# Altium schematic sheet MCU.SchDoc
size 431 x 279 mm; DocumentNumber: 3; SheetNumber: 3; SheetTotal: 7
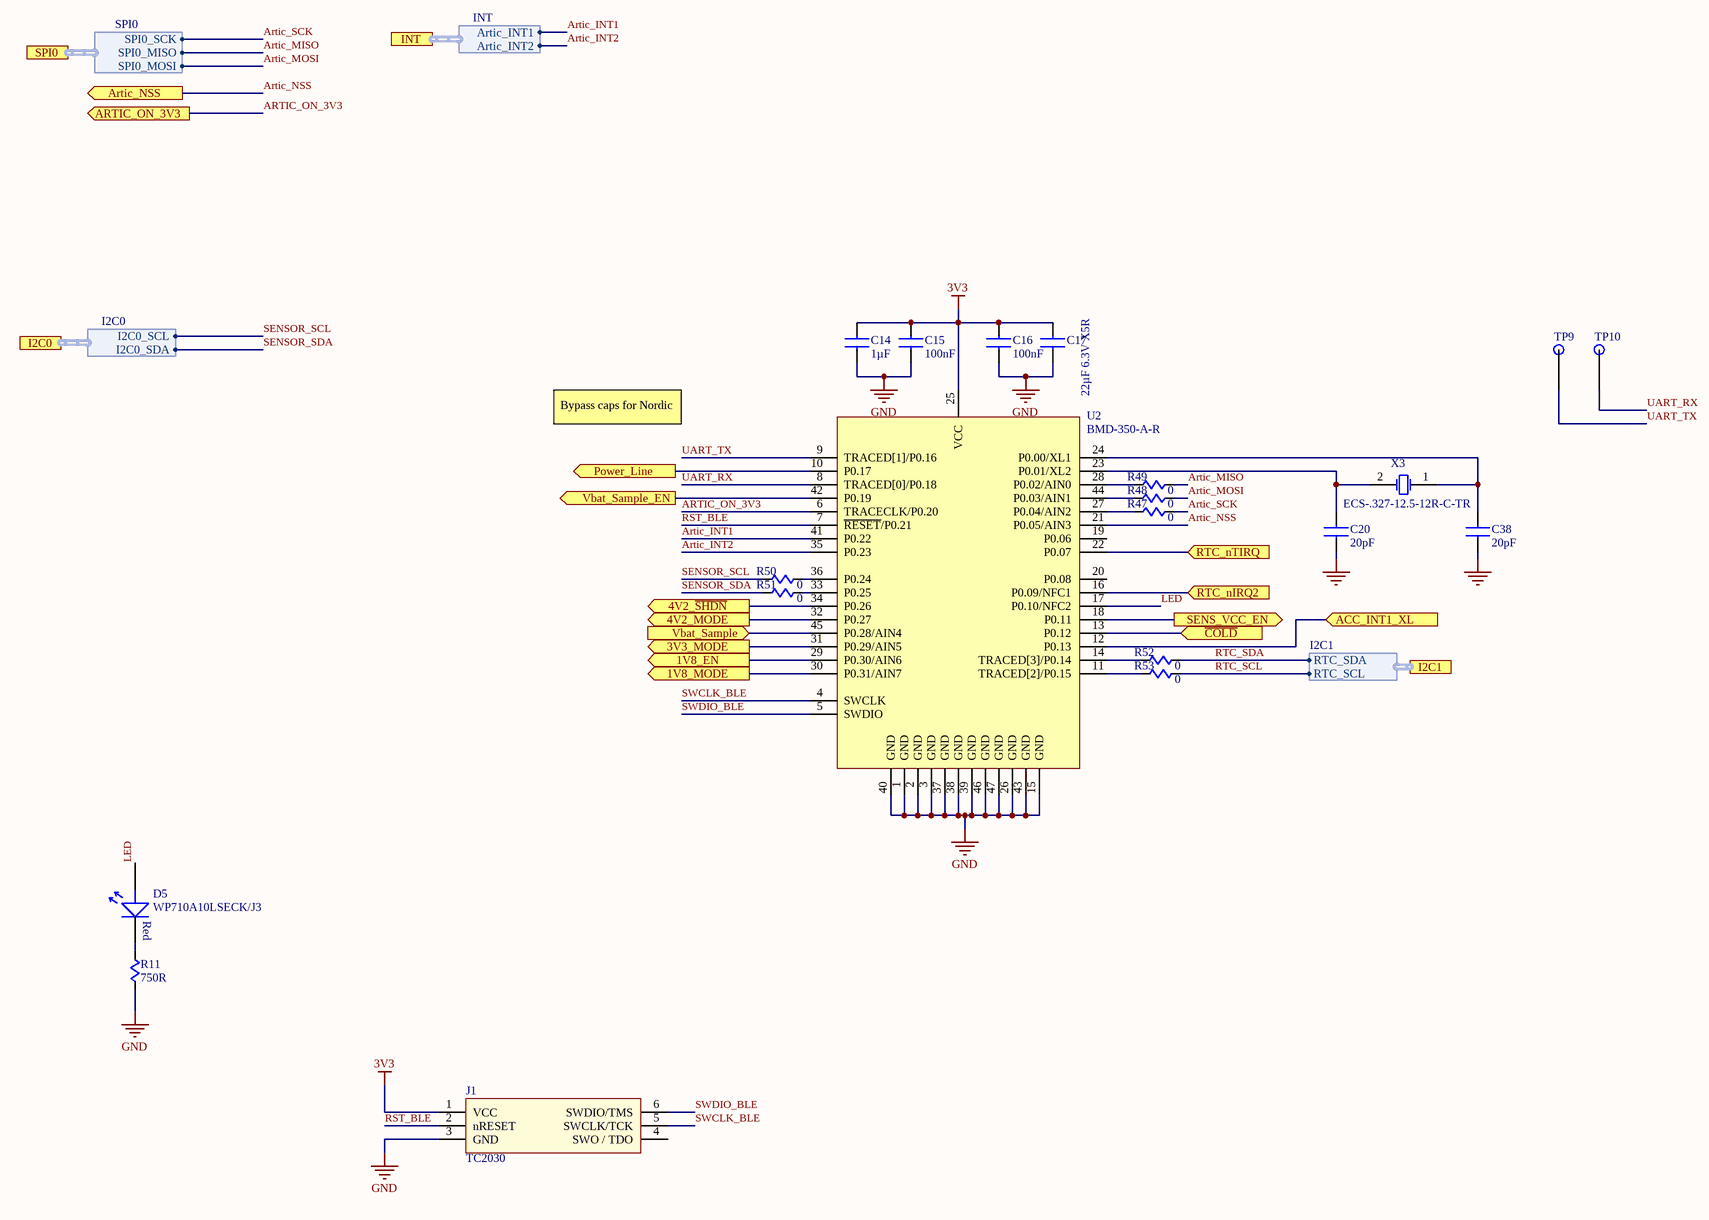
[diagram p0: MCU.SchDoc]

## Parts
C14  1µF  [CAPC1005N-0402]
C15  100nF  [CAPC1005N-0402]
C16  100nF  [CAPC1005N-0402]
C17  22µF 6.3V X5R  [CAPC1608N-0603]
C20  20pF  [CAPC1005N-0402]
C38  20pF  [CAPC1005N-0402]
D5  WP710A10LSECK/J3  [T-1 (3mm)]
J1  TC2030  [TC2030 - No Clips]  (no BOM)
R11  750R  [Chip Res 1608_0603 MMC]
R47  0  [RESC0402(1005)_N]
R48  0  [RESC0402(1005)_N]
R49  0  [RESC0402(1005)_N]
R50  0  [RESC0402(1005)_N]
R51  0  [RESC0402(1005)_N]
R52  0  [RESC0402(1005)_N]
R53  0  [RESC0402(1005)_N]
TP9  (no value)  [TestPoint_1mm]  (no BOM)
TP10  (no value)  [TestPoint_1mm]  (no BOM)
U2  BMD-350-A-R  [BMD-350]
X3  ECS-.327-12.5-12R-C-TR  [ECS-.327-12.5-12R-C-TR]

## Ports
1V8_EN (out), 1V8_MODE (out), 3V3_MODE (out), 4V2_MODE (out), 4V2_~{SHDN} (out), ACC_INT1_XL (in), Artic_NSS (out), ARTIC_ON_3V3 (out), I2C0 (harness I2C0), I2C1 (harness I2C1), INT (harness INT), Power_Line (out), RTC_nIRQ2 (in), RTC_nTIRQ (in), SENS_VCC_EN (out), SPI0 (harness SPI0), Vbat_Sample (in), Vbat_Sample_EN (out), ~{COLD} (in)

## Harnesses
I2C1: RTC_SDA, RTC_SCL
SPI0: SPI0_SCK, SPI0_MISO, SPI0_MOSI
I2C0: I2C0_SCL, I2C0_SDA
INT: Artic_INT1, Artic_INT2

## Nets
3V3: C14.1 C15.1 C16.1 C17.1 J1.1(VCC) U2.25(VCC)
GND: C14.2 C15.2 C16.2 C17.2 C20.2 C38.2 J1.3(GND) R11.1 U2.1(GND) U2.2(GND) U2.3(GND) U2.15(GND) U2.26(GND) U2.37(GND) U2.38(GND) U2.39(GND) U2.40(GND) U2.43(GND) U2.46(GND) U2.47(GND)
1V8_EN: U2.29(P0.30/AIN6) ; port 1V8_EN
1V8_MODE: U2.30(P0.31/AIN7) ; port 1V8_MODE
3V3_MODE: U2.31(P0.29/AIN5) ; port 3V3_MODE
4V2_MODE: U2.32(P0.27) ; port 4V2_MODE
4V2_~{SHDN}: U2.34(P0.26) ; port 4V2_~{SHDN}
~{COLD}: U2.13(P0.12) ; port ~{COLD}
ACC_INT1_XL: U2.12(P0.13) ; port ACC_INT1_XL
Artic_INT1: U2.41(P0.22) ; port INT.Artic_INT1
Artic_INT2: U2.35(P0.23) ; port INT.Artic_INT2
Artic_MISO: R49.2 ; port SPI0.SPI0_MISO
Artic_MOSI: R48.2 ; port SPI0.SPI0_MOSI
Artic_NSS: U2.21(P0.05/AIN3) ; port Artic_NSS
ARTIC_ON_3V3: U2.6(TRACECLK/P0.20) ; port ARTIC_ON_3V3
Artic_SCK: R47.2 ; port SPI0.SPI0_SCK
LED: D5.1(Anode) U2.17(P0.10/NFC2)
Power_Line: U2.10(P0.17) ; port Power_Line
RST_BLE: J1.2(nRESET) U2.7(~{RESET}/P0.21)
RTC_nIRQ2: U2.16(P0.09/NFC1) ; port RTC_nIRQ2
RTC_nTIRQ: U2.22(P0.07) ; port RTC_nTIRQ
RTC_SCL: R53.2 ; port I2C1.RTC_SCL
RTC_SDA: R52.2 ; port I2C1.RTC_SDA
SENS_VCC_EN: U2.18(P0.11) ; port SENS_VCC_EN
SENSOR_SCL: R50.1 ; port I2C0.I2C0_SCL
SENSOR_SDA: R51.1 ; port I2C0.I2C0_SDA
SWCLK_BLE: J1.5(SWCLK/TCK) U2.4(SWCLK)
SWDIO_BLE: J1.6(SWDIO/TMS) U2.5(SWDIO)
UART_RX: TP10.TP U2.8(TRACED[0]/P0.18)
UART_TX: TP9.TP U2.9(TRACED[1]/P0.16)
Vbat_Sample: U2.45(P0.28/AIN4) ; port Vbat_Sample
Vbat_Sample_EN: U2.42(P0.19) ; port Vbat_Sample_EN
NetC20_1: C20.1 U2.23(P0.01/XL2) X3.2(X2)
NetC38_1: C38.1 U2.24(P0.00/XL1) X3.1(X1)
NetD5_2: D5.2(Cathode) R11.2
NetR47_1: R47.1 U2.27(P0.04/AIN2)
NetR48_1: R48.1 U2.44(P0.03/AIN1)
NetR49_1: R49.1 U2.28(P0.02/AIN0)
NetR50_2: R50.2 U2.36(P0.24)
NetR51_2: R51.2 U2.33(P0.25)
NetR52_1: R52.1 U2.14(TRACED[3]/P0.14)
NetR53_1: R53.1 U2.11(TRACED[2]/P0.15)

Not connected (* = marked no-connect by the designer): J1 4(SWO_/_TDO); U2 19(P0.06) 20(P0.08)

## Notes on the sheet
- Bypass caps for Nordic
- 554 E 15th Ave.
- Vancouver, BC
- PCB SCHEMATIC
- V5T 2R5
- DESIGNED BY
  DRAWN BY
  APPROVED BY
  DATE
- DWG TYPE
  PCB SCH.
  PROJECT
  PCB #
- REV  =Revision
- SHT  =SheetNumber OF =SheetTotal

## Library data of the parts
C14 = CMP-02706-4: CAP CER 1UF 6.3V X7R 0402 ±10%; Manufacturer: Samsung Electro-Mechanics America, Inc.; Manufacturer Part Number: CL05B105KQ5NQNC; RevisionId: 2; AccessRights: 2147483647; Folder: MW_Parts\Components\Capacitors\Ceramic\Ceramic Filters\0402\X7R\; ContentType: Component; AncestorItemRevisionGUID: FD93AFD0-5032-408C-A550-1F4FCEC40B04; LifeCycleStateGUID: 706004B5-C76E-482E-903B-BA0E4FAE086A; ReleaseDate: 21/08/2017 11:02:52 PM; ContentTypeGUID: CB3C11C4-E317-11DF-B822-12313F0024A2; ItemGUID: 5B2E3594-B687-4FDE-A8F8-DCF9F15A9421; ItemHRID: CMP-02706; FolderGUID: EC3CA227-945F-4B62-A70C-0C1E94DF012A; LifeCycle: Draft; ComponentType: Capacitor; Capacitance: 1µF; Temperature Coefficient: X7R; Tolerance: ±10%; Voltage: 6.3V
C15 C16 = CMP-02680-4: CAP CER 0.1UF 10V X7R 0402 ±5%; Manufacturer: Samsung Electro-Mechanics America, Inc.; Manufacturer Part Number: CL05B104JP5NNNC; RevisionId: 2; AccessRights: 2147483647; Folder: MW_Parts\Components\Capacitors\Ceramic\Ceramic Filters\0402\X7R\; ContentType: Component; AncestorItemRevisionGUID: B5B9AEA9-2888-4609-98C5-D2A143A2E055; LifeCycleStateGUID: 706004B5-C76E-482E-903B-BA0E4FAE086A; ReleaseDate: 21/08/2017 11:02:50 PM; ContentTypeGUID: CB3C11C4-E317-11DF-B822-12313F0024A2; ItemGUID: 98D0CBC0-CD69-4B1B-A7E9-949A7B6C034B; ItemHRID: CMP-02680; FolderGUID: EC3CA227-945F-4B62-A70C-0C1E94DF012A; LifeCycle: Draft; ComponentType: Capacitor; Capacitance: 100nF; Temperature Coefficient: X7R; Tolerance: ±5%; Voltage: 10V
C17 = CMP-03705-2: CAP CER 22UF 6.3V X5R 0603 ±10%; Manufacturer: Samsung Electro-Mechanics America, Inc.; Manufacturer Part Number: CL10A226KQ8NRNE; Capacitance: 22µF; Temperature Coefficient: X5R; Tolerance: ±10%; Voltage: 6.3V
C20 C38 = CMP-02801-2: CAP CER 20PF 50V C0G/NP0 0402 ±5%; Manufacturer: Samsung Electro-Mechanics America, Inc.; Manufacturer Part Number: CL05C200JB5NNNC; Temperature Coefficient: C0G, NP0; Capacitance: 20pF; Tolerance: ±5%; Voltage: 50V
D5 = CMP-04118-1: Red 625nm LED Indication - Discrete 1.8V Radial; Manufacturer: Kingbright; Current - Test: 2mA; Millicandela Rating: 320mcd; Viewing Angle: 34°; Color: Red; Manufacturer Part Number: WP710A10LSECK/J3; Voltage - Forward (Vf) (Typ): 1.8V; Wavelength - Dominant: 625nm
J1 = CMP-003-0005-4: The TC2050-CTX and TC2030-CTL-NL are Plug-of-Nails™ Spring-Pin cables intended for ARM CORTEX SWD (Single; Manufacturer: Tag Connect; Manufacturer Part Number: TC2030
R11 = CMP-00469-2: 750R 0.1W ±5%; Manufacturer: Yageo; Manufacturer Part Number: RC0603JR-07750RL; Power: 0.1W; Resistance: 750R; Tolerance: ±5%
R47-R53 = CMP-02011-4: RES SMD 0.0OHM JUMPER 1/16W 0402; Manufacturer: Yageo; Manufacturer Part Number: RC0402JR-070RL; RevisionId: 3; AccessRights: 2147483647; Folder: MW_Parts\Components\Resistors\0402\; ContentType: Component; Power: 1/16; LifeCycleStateGUID: 706004B5-C76E-482E-903B-BA0E4FAE086A; ReleaseDate: 16/08/2017 05:04:55 PM; ContentTypeGUID: CB3C11C4-E317-11DF-B822-12313F0024A2; ItemGUID: EB0E4010-FD26-4F9E-B9EF-C7D1A7F136A7; ItemHRID: CMP-02011; FolderGUID: FF00D775-EA76-40F5-8F49-C5946BC46B28; LifeCycle: Draft; ComponentType: Resistor; Resistance: 0
TP9 TP10 = CMP-ROOT-0000-6: Test Point - 1mm pad; RevisionId: 5; AccessRights: 2147483647; Folder: MW_Parts\Components\PCB Artwork (Logos, Fiducials, Easter Eggs, Etc.)\Test Points\; ContentType: Component; AncestorItemRevisionGUID: 4BCAE504-19DF-475C-9848-C1A31AEBDD4F; LifeCycleStateGUID: 706004B5-C76E-482E-903B-BA0E4FAE086A; ReleaseDate: 23/08/2017 03:25:20 AM; ContentTypeGUID: CB3C11C4-E317-11DF-B822-12313F0024A2; ItemGUID: CE638ACE-1002-4898-A02D-C9FAD70242BD; ItemHRID: CMP-ROOT-0000; FolderGUID: 826AF0AF-D3B5-4CC2-AA9D-34285EE49F0B; LifeCycle: Draft
U2 = CMP-ROOT-0041-4: MOD BLE 4.2 NORDIC NRF52832 SOC; Manufacturer: Rigado, Inc.; Manufacturer Part Number: BMD-350-A-R
X3 = CMP-04600-1: 32.768kHz ±10ppm Crystal 12.5pF 70 kOhms 2-SMD, No Lead; Manufacturer: ECS Inc.; Manufacturer Part Number: ECS-.327-12.5-12R-C-TR